# EAGLE design laser_sync (EAGLE 5.09)
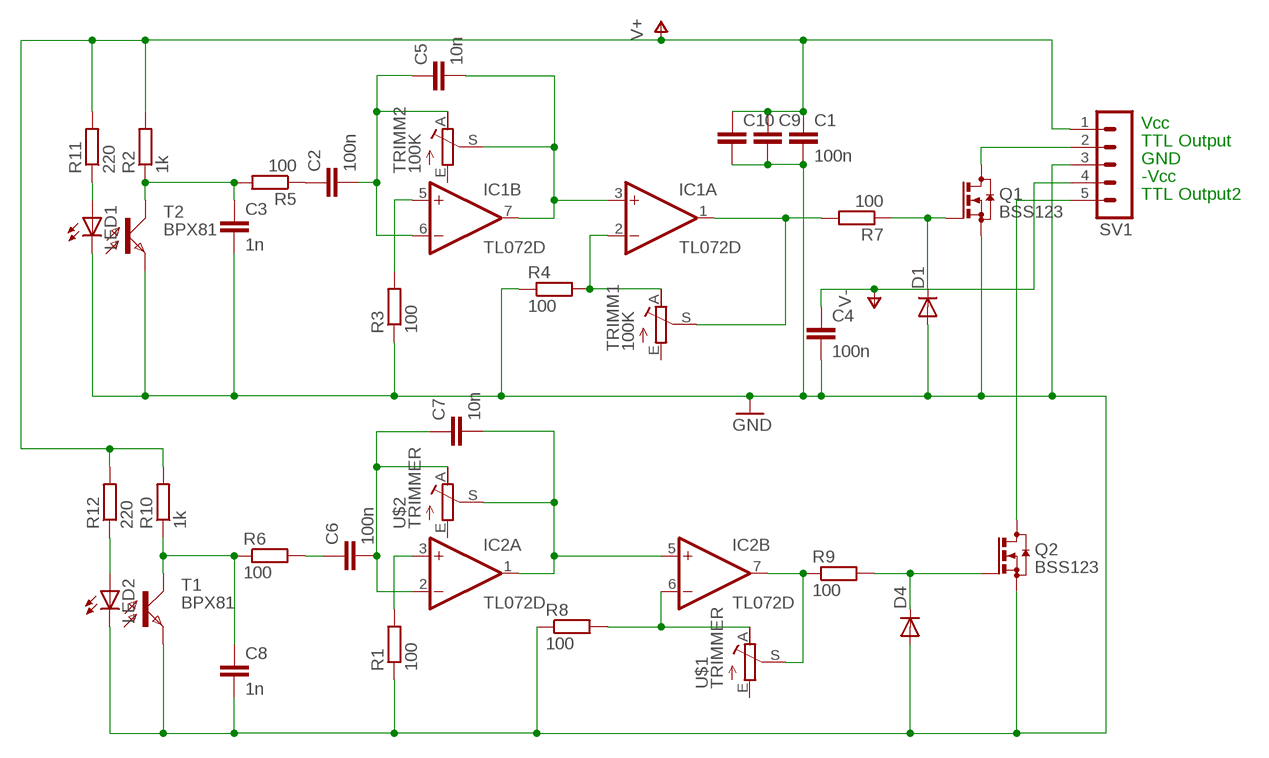
[diagram p0: schematic, sheet 1]

## Parts
C1  100n  C-EUC0805  [C0805]
C2  100n  C-EUC0805  [C0805]
C3  1n  C-EUC0805  [C0805]
C4  100n  C-EUC0805  [C0805]
C5  10n  C-EUC0805  [C0805]
C6  100n  C-EUC0805  [C0805]
C7  10n  C-EUC0805  [C0805]
C8  1n  C-EUC0805  [C0805]
C9  C-EUC1210  [C1210]
C10  C-EUC1210  [C1210]
D1  DIODE-SOD123  [SOD123]
D4  DIODE-SOD123  [SOD123]
IC1  TL072D  [SO08]
IC2  TL072D  [SO08]
LED1  LED5MM  [LED5MM]
LED2  LED5MM  [LED5MM]
Q1  BSS123  [SOT23]
Q2  BSS123  [SOT23]
R1  100  R-EU_M0805  [M0805]
R2  1k  R-EU_0207/7  [0207/7]
R3  100  R-EU_M0805  [M0805]
R4  100  R-EU_R0805  [R0805]
R5  100  R-EU_M0805  [M0805]
R6  100  R-EU_M0805  [M0805]
R7  100  R-EU_R0805  [R0805]
R8  100  R-EU_M0805  [M0805]
R9  100  R-EU_M0805  [M0805]
R10  1k  R-EU_0207/7  [0207/7]
R11  220  R-EU_0207/7  [0207/7]
R12  220  R-EU_0207/7  [0207/7]
SV1  MA05-1  [MA05-1]
T1  BPX81  [BPX81]
T2  BPX81  [BPX81]
TRIMM1  100K  TRIMMER  [TRIMMER_SMD]
TRIMM2  100K  TRIMMER  [TRIMMER_SMD]
U$1  TRIMMER  [TRIMMER_SMD]
U$2  TRIMMER  [TRIMMER_SMD]

## Nets
GND: C1.2 C3.2 C4.2 C8.2 C9.2 C10.2 D1.A D4.A LED1.K(C) LED2.K(C) Q1.2(S) Q2.2(S) R1.1 R3.1 R4.1 R8.1 SV1.3 T1.E T2.E
N$1: IC1.2(A:-IN) R4.2 TRIMM1.A
N$2: C3.1 R2.1 R5.2 T2.C
N$3: D1.C Q1.1(G) R7.1
N$4: IC1.1(A:OUT) R7.2 TRIMM1.S
N$5: C2.2 C5.1 IC1.6(B:-IN) TRIMM2.A
N$6: C5.2 IC1.3(A:+IN) IC1.7(B:OUT) TRIMM2.S
N$7: IC1.5(B:+IN) R3.2
N$8: C8.1 R6.1 R10.1 T1.C
N$9: IC2.6(B:-IN) R8.2 U$1.A
N$10: Q2.3(D) SV1.5
N$11: C2.1 R5.1
N$12: C6.1 R6.2
N$13: C6.2 C7.1 IC2.2(A:-IN) U$2.A
N$14: IC2.3(A:+IN) R1.2
N$16: C1.1 C9.1 C10.1 R2.2 R10.2 R11.2 R12.2 SV1.1 ; supply symbol labelled V+
N$17: IC2.7(B:OUT) R9.1 U$1.S
N$18: D4.C Q2.1(G) R9.2
N$22: C7.2 IC2.1(A:OUT) IC2.5(B:+IN) U$2.S
N$24: LED2.A R12.1
N$25: Q1.3(D) SV1.2
N$26: LED1.A R11.1
V-: C4.1 SV1.4
Unconnected: TRIMM1.E TRIMM2.E U$1.E U$2.E

## Notes on the sheet
- Vcc
- TTL Output
- GND
- -Vcc
- TTL Output2

## Power pins joined to a net without a drawn wire
N$16: IC1.8(P:V+) IC2.8(P:V+)
V-: IC1.4(P:V-) IC2.4(P:V-)

## Library data of the parts
C1-C10 = rcl:C-EU: CAPACITOR, European symbol
D1 D4 = diode:DIODE-: DIODE
IC1 IC2 = linear:TL072: OP AMP
LED1 LED2 = led:LED: LED OSRAM: - CHIPLED LG R971, LG N971, LY N971, LG Q971, LY Q971, LO R971, LY R971 LH N974, LH R974 LS Q976, LO Q976, LY Q976 LO Q996 - Hyper CHIPLED LW Q18S LB Q993, LB Q99A, LB R99A - SideLED LS A670, LO A670, LY A670, LG A670, LP A670 LB A673, LV A673, LT A673, LW A673 LH A674 LY A675 LS A676, LA A676, LO A676, LY A676, LW A676 LS A679, LY A679, LG A679 - Hyper Micro SIDELED® LS Y876, LA Y876, LO Y876, LY Y876 LT Y87S - SmartLED LW L88C, LW L88S LB L89C, LB L89S, LG L890 LS L89K, LO L89K, LY L89K LS L896, LA L896, LO L896, LY L896 - TOPLED LS T670, LO T670, LY T670, LG T670, LP T670 LSG T670, LSP T670, LSY T670, LOP T670, LYG T670 LG T671, LOG T671, LSG T671 LB T673, LV T673, LT T673, LW T673 LH T674 LS T676, LA T676, LO T676, LY T676, LB T676, LH T676, LSB T676, LW T676 LB T67C, LV T67C, LT T67C, LS T67K, LO T67K, LY T67K, LW E67C LS E67B, LA E67B, LO E67B, LY E67B, LB E67C, LV E67C, LT E67C LW T67C LS T679, LY T679, LG T679 LS T770, LO T770, LY T770, LG T770, LP T770 LB T773, LV T773, LT T773, LW T773 LH T774 LS E675, LA E675, LY E675, LS T675 LS T776, LA T776, LO T776, LY T776, LB T776 LHGB T686 LT T68C, LB T68C - Hyper Mini TOPLED® LB M676 - Mini TOPLED Santana® LG M470 LS M47K, LO M47K, LY M47K Source: http://www.osram.convergy.de LUXEON: - LUMILED® LXK2-PW12-R00, LXK2-PW12-S00, LXK2-PW14-U00, LXK2-PW14-V00 LXK2-PM12-R00, LXK2-PM12-S00, LXK2-PM14-U00 LXK2-PE12-Q00, LXK2-PE12-R00, LXK2-PE12-S00, LXK2-PE14-T00, LXK2-PE14-U00 LXK2-PB12-K00, LXK2-PB12-L00, LXK2-PB12-M00, LXK2-PB14-N00, LXK2-PB14-P00, LXK2-PB14-Q00 LXK2-PR12-L00, LXK2-PR12-M00, LXK2-PR14-Q00, LXK2-PR14-R00 LXK2-PD12-Q00, LXK2-PD12-R00, LXK2-PD12-S00 LXK2-PH12-R00, LXK2-PH12-S00 LXK2-PL12-P00, LXK2-PL12-Q00, LXK2-PL12-R00 Source: www.luxeon.com KINGBRIGHT: KA-3528ASYC Source: www.kingbright.com
Q1 Q2 = transistor-small-signal:BSS123: N-CHANNEL MOS FET
R1 R3 R5-R12 = resistor:R-EU_: RESISTOR, European symbol
R2 R4 = rcl:R-EU_: RESISTOR, European symbol
SV1 = con-lstb:MA05-1: PIN HEADER
T1 T2 = opto-trans-siemens:BPX81: PHOTO TRANSISTOR
TRIMM1 TRIMM2 U$1 U$2 = siro:TRIMMER

## Board
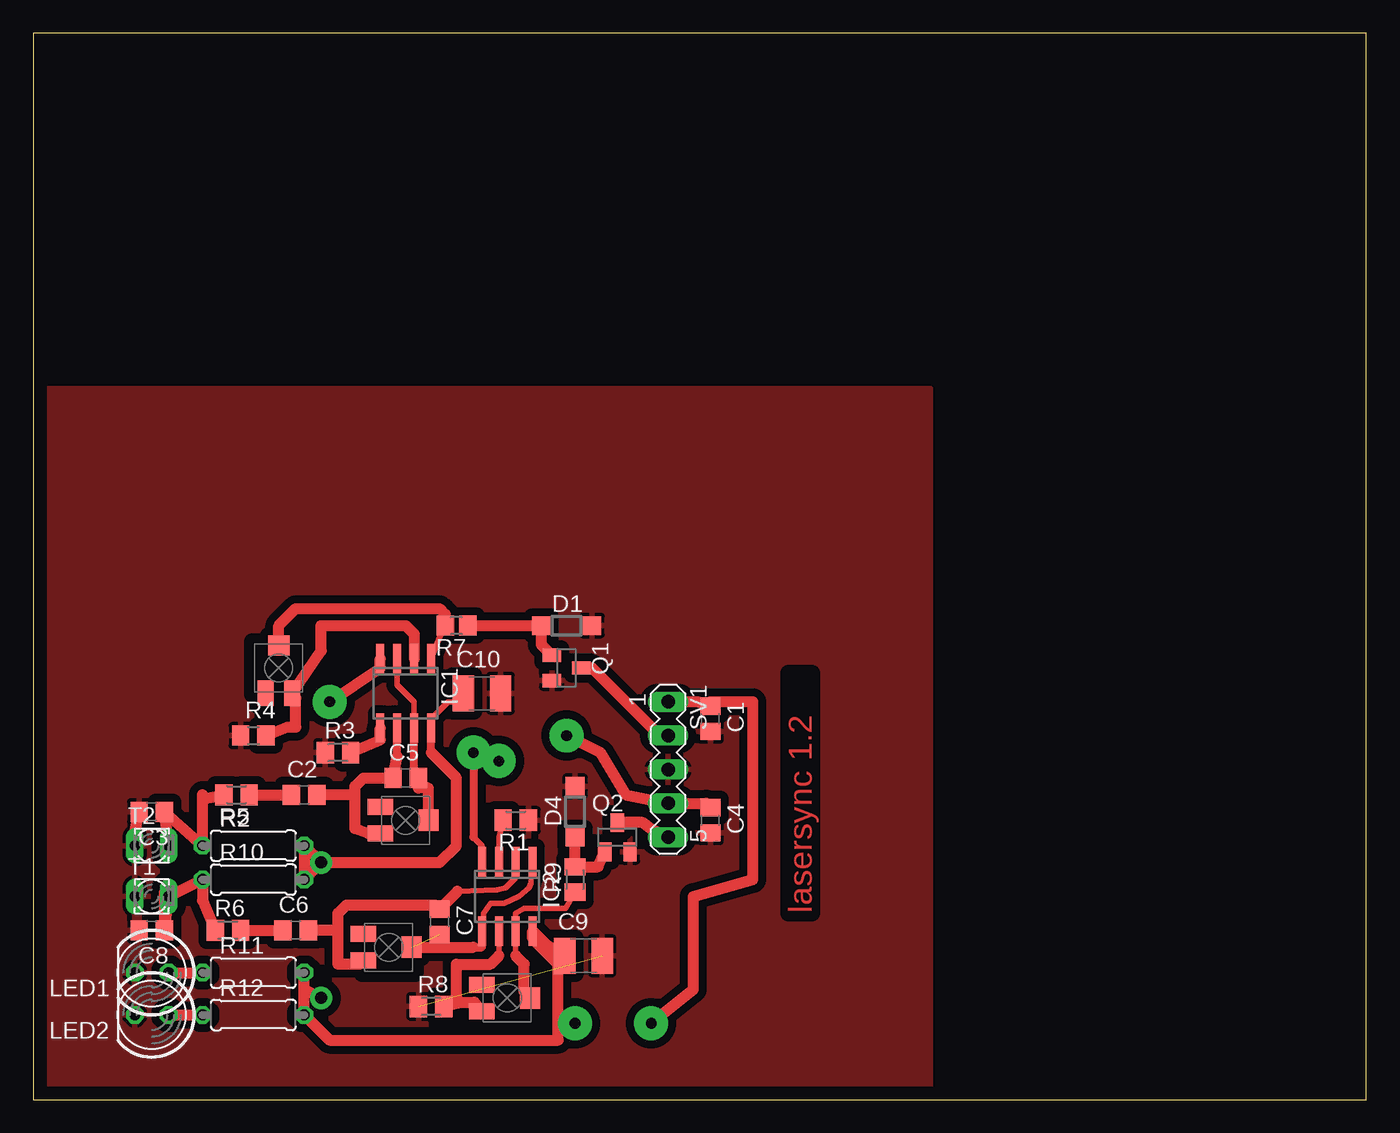
[diagram p1: board, top side]
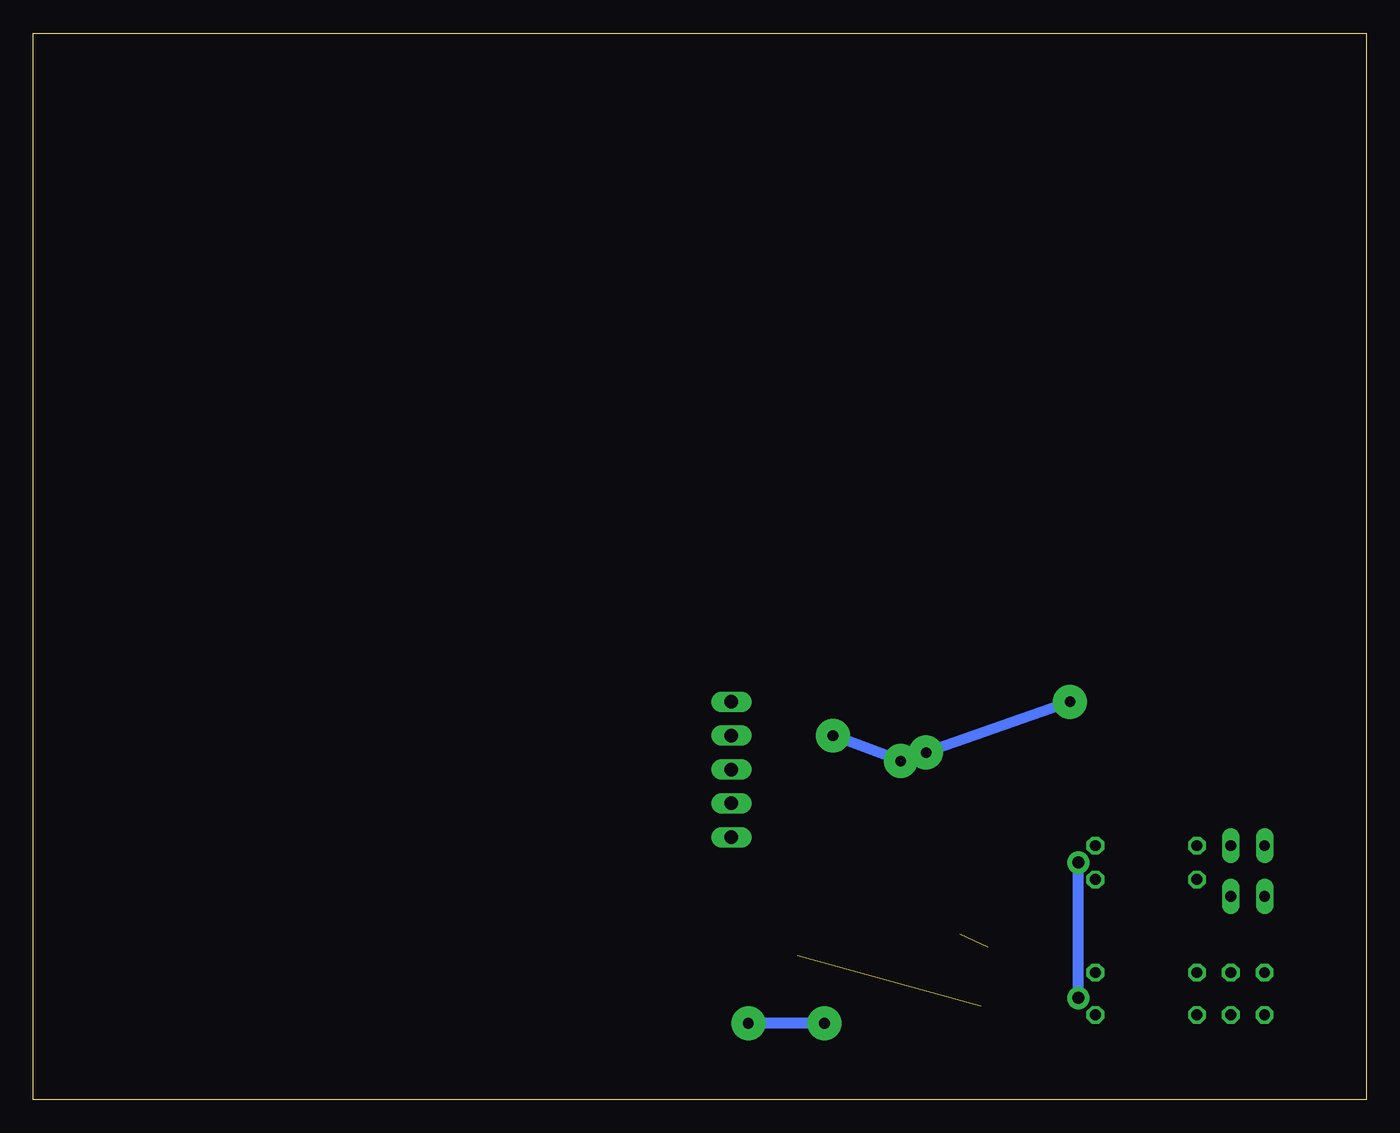
[diagram p2: board, bottom side, seen from below]

Size 100 x 80 mm. Coordinates in mm from the lower left corner, seen from the top.
Outline: 0,0 100,0 100,80 0,80 0,0
Copper layers (1*16): Top 0.035mm / dielectric 1.5mm / Bottom 0.035mm
Design rules "default": minimum track width 10mil, minimum drill 24mil, track to track 8mil, track to pad 8mil, pad to pad 8mil, via to via 8mil, smd to smd 8mil, copper to edge 40mil, drill to drill 8mil, minimum pad ring 10mil, minimum via ring 8mil, stop-mask expansion 4mil, vias tented up to drill 0mil, thermal gap 10mil

### Footprints (pad centres in the part's own frame; a part is rotated, then mirrored left to right if it is on the bottom)
C0805 = smd 1.3 x 1.5: 1 -0.95,0; 2 0.95,0
C1210 = smd 1.6 x 2.7: 1 -1.4,0; 2 1.4,0
SOD123 = smd 1.4 x 1.4: A 1.9,0; C -1.9,0
SO08 = smd 0.6 x 2.2: 1 -1.905,-2.6; 2 -0.635,-2.6; 3 0.635,-2.6; 4 1.905,-2.6; 5 1.905,2.6; 6 0.635,2.6; 7 -0.635,2.6; 8 -1.905,2.6
LED5MM = drill 0.813 octagon: A -1.27,0; K 1.27,0
SOT23 = smd 1 x 1.4: 1 -0.95,-1.1; 2 0.95,-1.1; 3 0,1.1
M0805 = smd 1.3 x 1.6: 1 -0.95,0; 2 0.95,0
0207/7 = drill 0.813 octagon: 1 -3.81,0; 2 3.81,0
R0805 = smd 1.3 x 1.5: 1 -0.95,0; 2 0.95,0
R0805' = smd 1.3 x 1.5: 1 -0.85,0; 2 0.85,0
MA05-1 = drill 1.016 long: 1 -5.08,0; 2 -2.54,0; 3 0,0; 4 2.54,0; 5 5.08,0
BPX81 = drill 0.813 long: C 1.27,0; E -1.27,0
TRIMMER_SMD = smd 1.2 x 1.9: A 1,-1.9; E -1,-1.9 | smd 1.6 x 1.5: S 0,1.7

### Placement (x,y rotation side)
C1  50.8,28.57 270 top
C2  20.32,22.86 0 top
C3  8.89,21.59 180 top
C4  50.8,20.95 270 top
C5  27.94,24.13 0 top
C6  19.68,12.7 0 top
C7  30.48,13.34 270 top
C8  8.89,12.7 180 top
C9  41.27,10.79 0 top
C10  33.66,30.48 0 top
D1  40.01,35.56 0 top
D4  40.64,21.59 90 top
IC1  27.94,30.48 180 top
IC2  35.56,15.24 180 top
LED1  8.89,9.53 180 top
LED2  8.89,6.35 180 top
Q1  40.01,32.38 270 top
Q2  43.81,19.68 0 top
R1  36.2,20.95 180 top
R2  16.51,19.05 0 top
R3  22.86,26.04 0 top
R4  16.51,27.3 0 top
R5  15.24,22.86 180 top
R6  14.61,12.7 0 top
R7  100  [R0805']  31.75,35.56 180 top
R8  29.84,6.99 0 top
R9  40.64,16.51 90 top
R10  16.51,16.51 0 top
R11  16.51,9.53 0 top
R12  16.51,6.35 0 top
SV1  47.62,24.77 270 top
T1  8.89,15.24 0 top
T2  8.89,19.05 0 top
TRIMM1  18.41,32.38 0 top
TRIMM2  27.94,20.95 270 top
U$1  35.56,7.62 270 top
U$2  26.67,11.43 270 top

### Tracks (layer width: path | path; a pad name or v marks a point on that pad's centre or on a via)
GND  (1 unrouted)
  Top 0.813: 7.62,20 C3.2 7.94,21.27
  pour Top (isolate 0.61): 0,53.34 0,0 67.31,0 67.31,53.34
N$1
  Top 0.813: R4.2 19.05,27.94 19.68,27.94 19.68,30.12 TRIMM1.A 21.59,33.66 21.59,35.56 27.94,35.56 28.57,34.92 IC1.2
N$2
  Top 0.813: C3.1 9.84,21.27 | 12.7,22.55 12.7,22.86 | 12.7,22.55 R2.1 C3.1 | 12.7,22.55 R5.2 | T2.C C3.1
N$3
  Top 0.813: R7.1 D1.C 38.1,34.13 Q1.1
N$4
  Top 0.406: IC1.1 30.84,35.62 R7.2
  Top 0.813: R7.2 30.9,36.41 30.48,36.83 19.68,36.83 18.41,35.56 TRIMM1.S
N$5
  Top 0.61: 27.3,25.71 IC1.6
  Top 0.813: TRIMM2.A 25.13,19.95 24.13,20.32 24.13,22.86 | 27.3,25.71 C5.1 24.77,24.13 24.13,23.5 24.13,22.86 | 24.13,22.86 C2.2
N$6
  Top 0.406: IC1.3 27.3,31.11 28.57,29.84 IC1.7
  Top 0.61: C5.2 28.57,24.13 IC1.7
  Top 0.813: TRIMM2.S 29.64,23.38 28.89,23.38 C5.2
N$7
  Top 0.813: IC1.5 26.04,26.99 R3.2
N$8
  Top 0.813: 9.84,15.55 C8.1 T1.C R10.1 12.7,14.93 R6.1
N$9
  Top 0.406: 34.92,10.79 IC2.6
  Top 0.813: R8.2 32.07,7.3 | U$1.A 33.07,7.3 32.07,7.3 | 32.07,7.3 31.75,7.62 31.75,10.16 34.29,10.16 34.92,10.79
N$10
  Top 0.813: SV1.5 46.35,20.32 45.72,20.79 Q2.3
N$11
  Top 0.813: R5.1 C2.1
N$12
  Top 0.813: R6.2 C6.1
N$13
  Top 0.406: IC2.2 36.2,16.64 35.43,15.88 34.8,15.75 31.82,15.62
  Top 0.813: 22.86,12.7 22.86,10.16 24.5,10.16 U$2.A | 22.86,12.7 22.86,13.97 23.5,14.61 30.16,14.61 C7.1 31.82,15.62 | 22.86,12.7 C6.2
N$14
  Top 0.406: IC2.3 34.92,19.68 R1.2
N$16  (via drill 0.8 pad 2.54, 0.9 pad 1.68)
  Top 0.406: IC1.8 29.84,28.57 31.11,29.84 31.62,29.84 C10.1
  Top 0.61: 29.84,26.04 IC1.8
  Top 0.813: C9.1 38.55,11.56 IC2.8 37.47,12.06 39.37,10.16 39.37,5.71 | v46.35,5.71 49.53,8.26 49.53,15.24 53.98,16.51 53.98,29.84 50.8,29.84 C1.1 49.84,29.84 SV1.1 | 20.32,8.26 R12.2 22.23,4.45 39.37,4.45 39.37,5.71 | 20.32,8.26 R11.2 | v21.59,17.78 30.48,17.78 31.75,19.05 31.75,24.13 29.84,26.04 | v21.59,17.78 R2.2 R10.2 v21.59,17.78 | 20.32,8.26 v21.59,7.62 | 39.37,5.71 v40.64,5.71
  Bottom 0.813: v40.64,5.71 v46.35,5.71 | v21.59,7.62 v21.59,17.78
N$17
  Top 0.406: 36.2,10.79 IC2.7 36.2,13.97 36.83,14.35 39.94,14.35 R9.1 | U$1.S 36.83,8.05
  Top 0.813: 36.2,10.79 36.83,10.16 36.83,8.05
N$18
  Top 0.813: Q2.1 42.38,17.46 R9.2 D4.C
N$19  (via drill 0.8 pad 2.54)
  other vias: 34.92,25.4
N$20  (via drill 0.8 pad 2.54)
  other vias: 33.02,26.04
N$21  (via drill 0.8 pad 2.54)
  other vias: 22.23,29.84
N$22  (1 unrouted)
  Top 0.406: IC2.1 37.34,16.26 37.21,15.88 36.45,15.24 35.31,14.73 34.29,14.73 33.78,13.97 IC2.5
  Top 0.61: 33.02,11.43 33.66,11.43 IC2.5
  Top 0.813: U$2.S 33.02,11.43
N$24
  Top 0.813: LED2.A R12.1
N$25
  Top 0.813: Q1.3 41.91,32.38 46.99,27.3 SV1.2
N$26
  Top 0.813: LED1.A R11.1
V-  (via drill 0.6, 0.8 pad 2.54)  (2 unrouted)
  Top 0.406: IC2.4 33.66,19.05 33.02,19.68
  Top 0.61: v33.02,26.04 33.02,19.68
  Top 0.813: C4.1 50.48,22.23 SV1.4 44.45,22.86 42.55,26.04 v40.01,27.3 | v33.02,26.04 34.92,25.4 | IC1.4 26.04,32.38 22.23,29.84
  Bottom 0.813: 34.92,25.4 v40.01,27.3 | 22.23,29.84 v33.02,26.04

### Text on the board
Top: lasersync 1.2